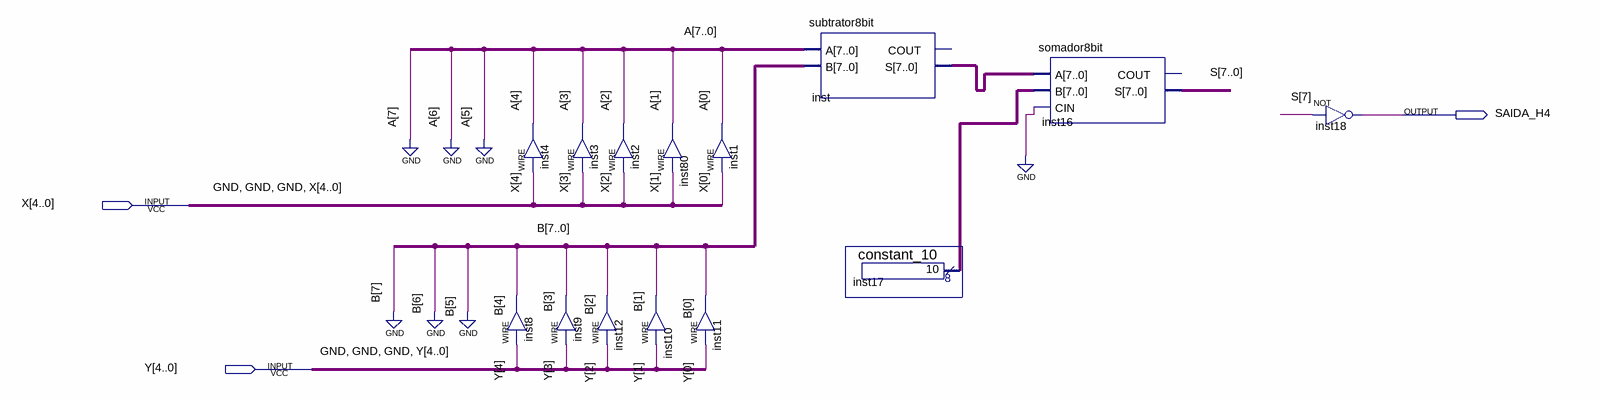
[diagram p0: schematic sheet]
// Quartus schematic neuronio_h4.bdf as structural Verilog: 14 symbols, 3 pins
module neuronio_h4 (
  input  [4:0] X,
  input  [4:0] Y,
  output SAIDA_H4
);

  wire [4:0] A, B;
  wire [7:0] inst17_result, inst_s, S;

  assign A[4] = X[4];  // WIRE inst4
  assign B[4] = Y[4];  // WIRE inst8
  assign A[3] = X[3];  // WIRE inst3
  assign B[3] = Y[3];  // WIRE inst9
  assign B[2] = Y[2];  // WIRE inst12
  assign A[2] = X[2];  // WIRE inst2
  assign A[1] = X[1];  // WIRE inst80
  assign B[1] = Y[1];  // WIRE inst10
  assign A[0] = X[0];  // WIRE inst1
  assign B[0] = Y[0];  // WIRE inst11
  subtrator8bit inst (.A({3'b000, A}), .B({3'b000, B}), .S(inst_s));  // open: COUT
  constant_10 inst17 (.result(inst17_result));
  somador8bit inst16 (.A(inst_s), .B(inst17_result), .CIN(1'b0), .S(S));  // open: COUT
  not inst18 (SAIDA_H4, S[7]);
endmodule
